# EAGLE design Adapter-IO4-Breakout (EAGLE 7.7.0)
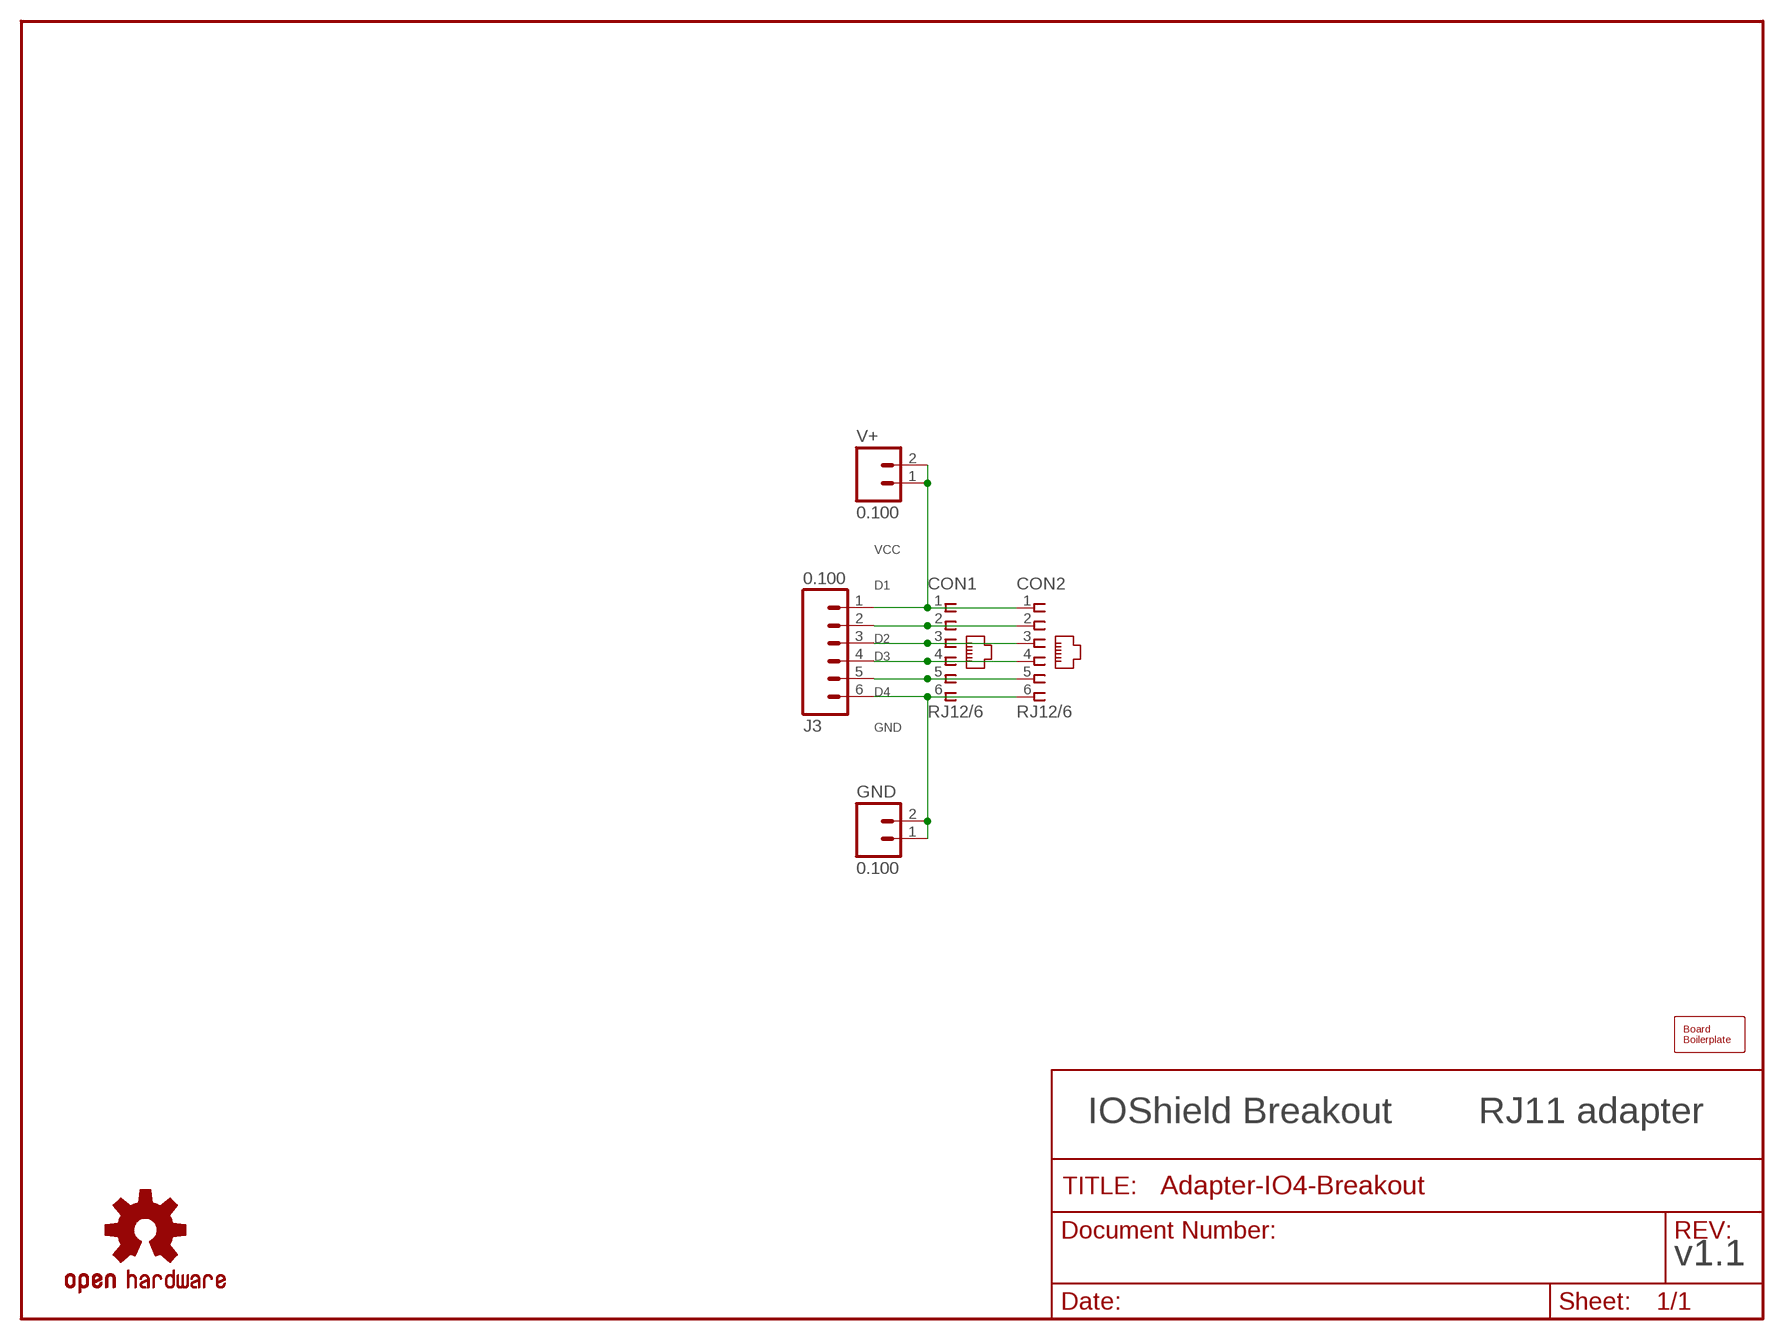
[diagram p0: schematic, sheet 1]

## Parts
BOARD1  BOARD  BOARD50X50-NOHOLES  [BOARD-SEEED5X5-NOHOLES]
CON1  RJ12/6  CONNECTOR-RJ25-6P6C  [RJ25-PANEL]
CON2  RJ12/6  CONNECTOR-RJ25-6P6C  [RJ25-PANEL]
GND  0.100  CONNECTOR-M021X02-LOCK  [1X02_LOCK]
J3  0.100  CONNECTOR-M06LOCK  [1X06_LOCK]
U$1  OSHW  OSHW-LOGOM  [OSHW-LOGO-M]
V+  0.100  CONNECTOR-M021X02-LOCK  [1X02_LOCK]

## Nets
D1: CON1.2 CON2.2 J3.2
D2: CON1.3 CON2.3 J3.3
D3: CON1.4 CON2.4 J3.4
D4: CON1.5 CON2.5 J3.5
GND [power]: CON1.6 CON2.6 GND.1(A) GND.2(B) J3.6
VCC [power]: CON1.1 CON2.1 J3.1 V+.1(A) V+.2(B)

## Notes on the sheet
- IOShield Breakout | RJ11 adapter
- v1.1

## Library data of the parts
BOARD1 = SPCoast:BOARD
CON1 CON2 = SPCoast:CONNECTOR-RJ25: AMP connector; AMP: 520250-3; OPL: none
GND V+ = SPCoast:CONNECTOR-M02: PHOENIX CONNECTOR
J3 = SPCoast:CONNECTOR-M06: Header 6 Standard 6-pin 0.1" header
U$1 = SparkFun:OSHW-LOGO: Open Source Hardware Logo This logo indicates the piece of hardware it is found on incorporates a OSHW license and/or adheres to the definition of open source hardware found here: http://freedomdefined.org/OSHW

## Net classes
0 default: width 0.305 mm, drill 0.6 mm, clearance 0.152 mm
1 power: width 0.61 mm

## Board
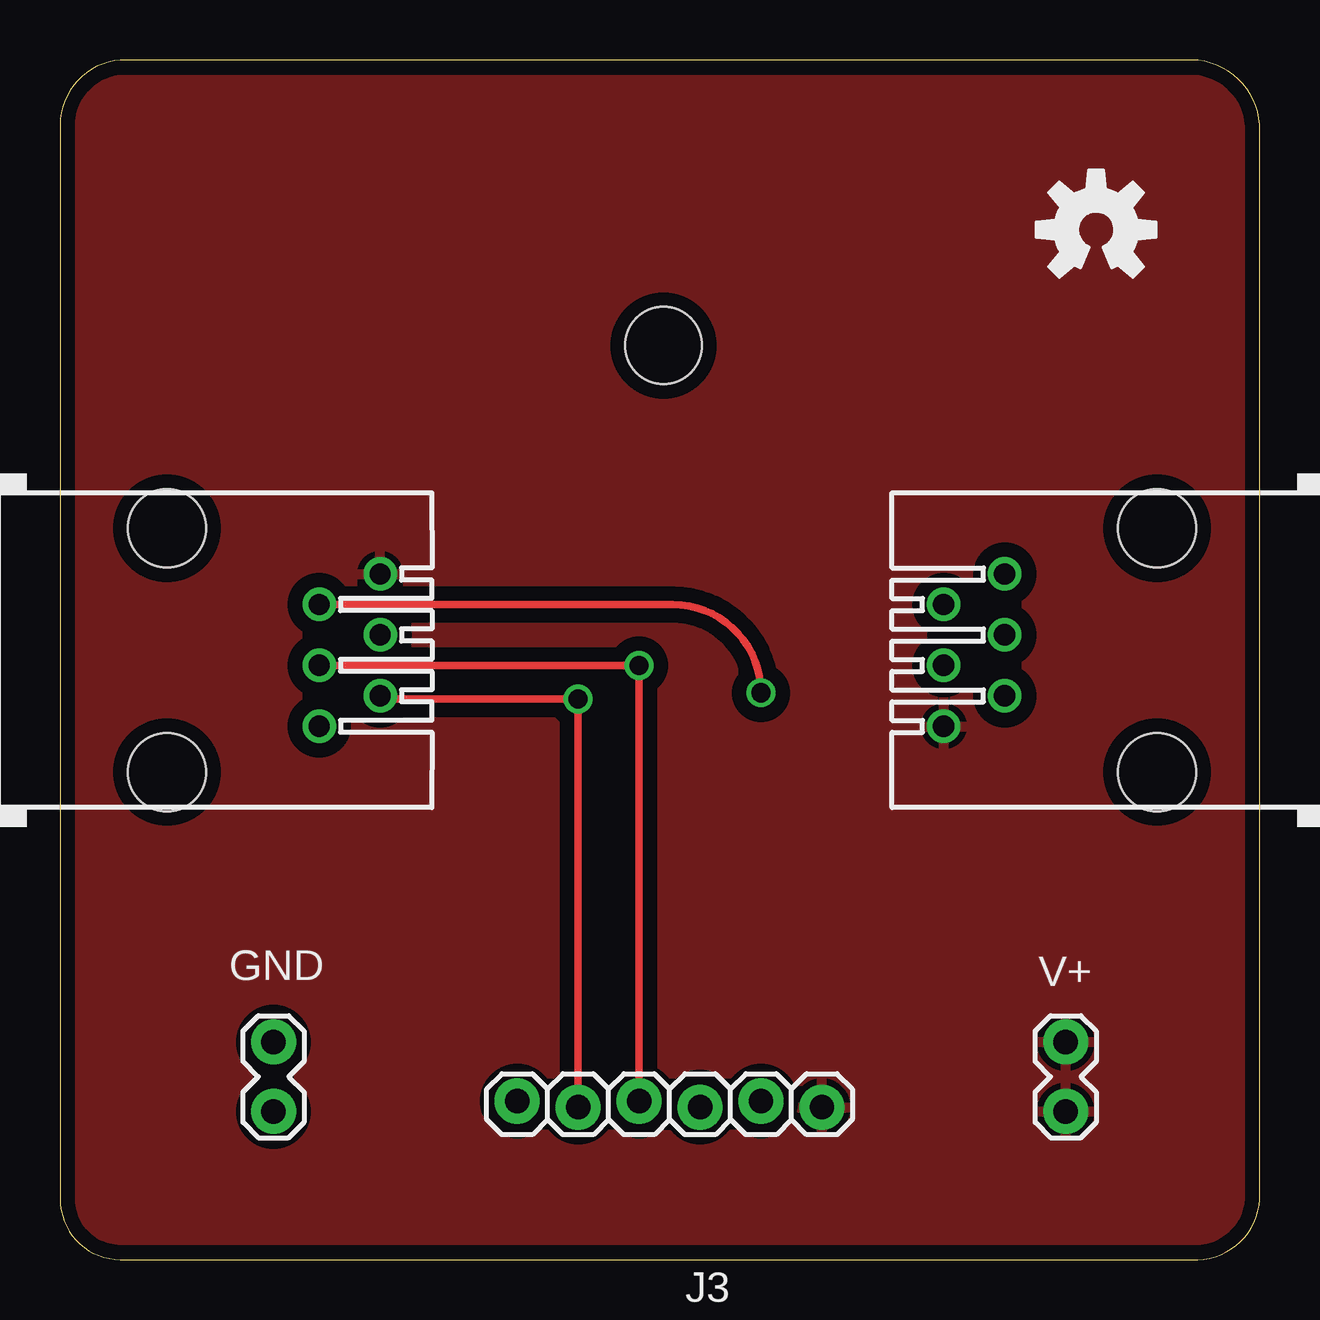
[diagram p1: board, top side]
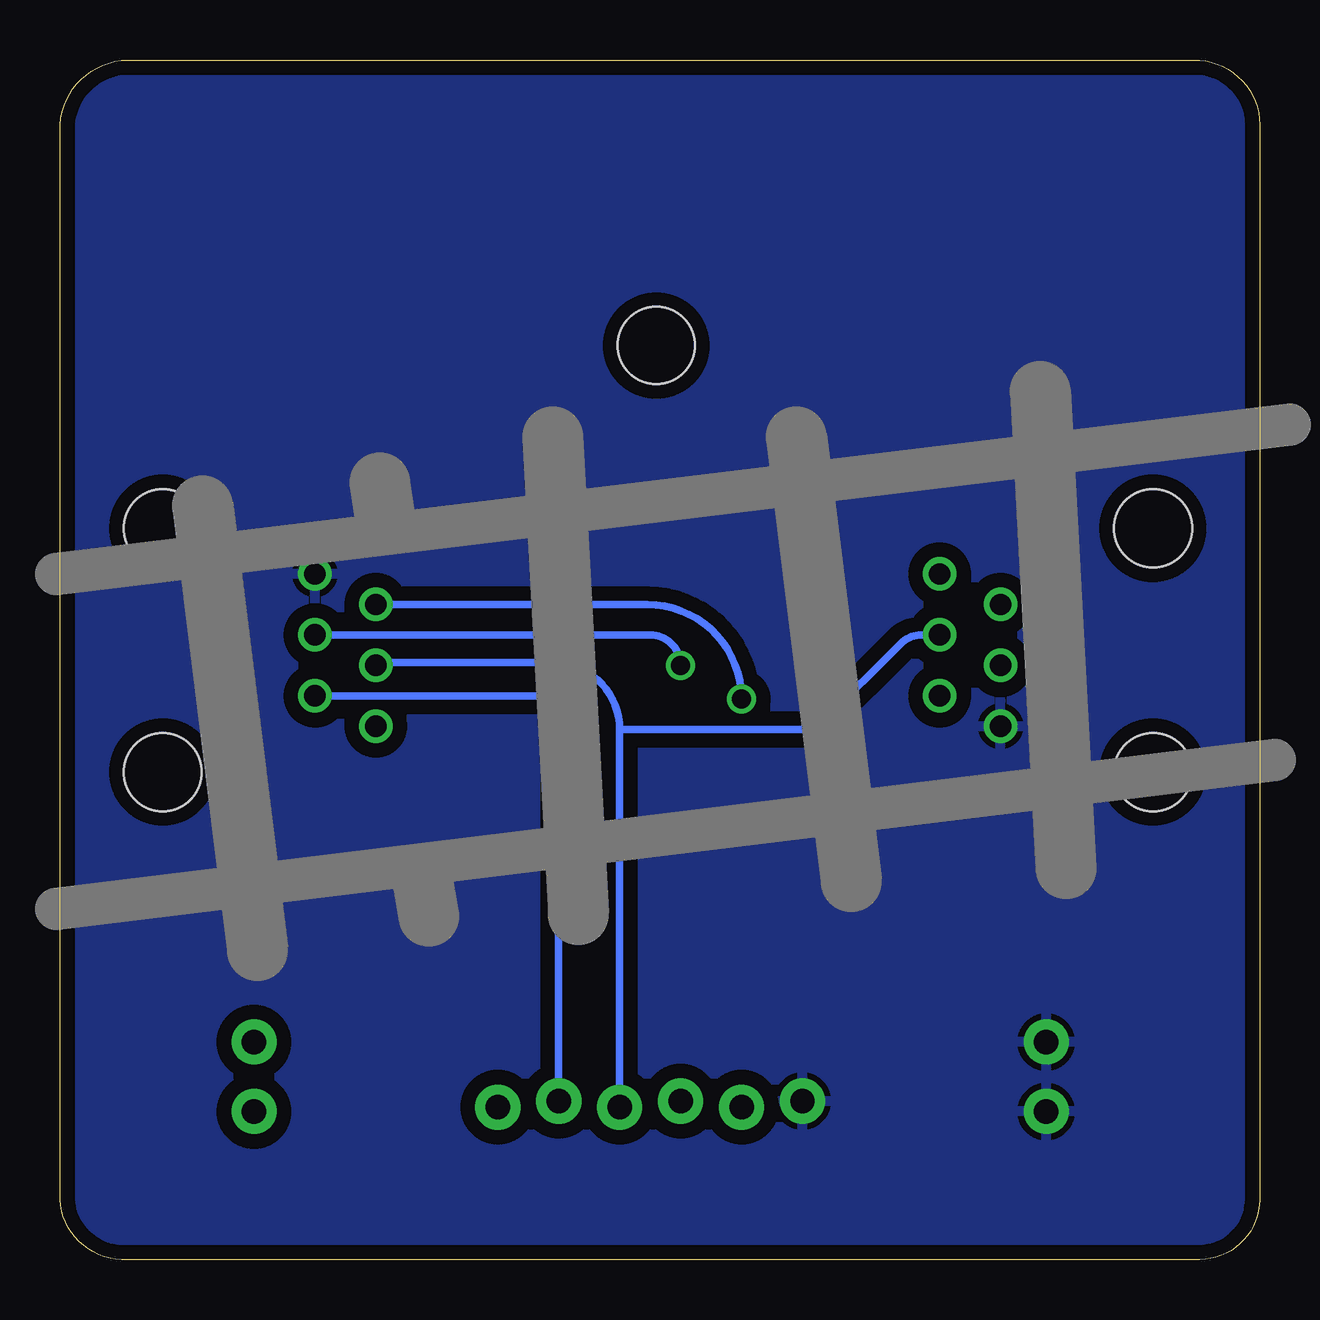
[diagram p2: board, bottom side, seen from below]

Size 50.01 x 50 mm. Coordinates in mm from the lower left corner, seen from the top.
Copper layers (1*16): Top 0.035mm / dielectric 1.5mm / Bottom 0.035mm
Design rules "Fusion_eagle_rule_v1.1": minimum track width 6mil, minimum drill 12mil, track to track 6mil, track to pad 6mil, pad to pad 6mil, via to via 6mil, smd to smd 0mil, copper to edge 10mil, drill to drill 10mil, minimum pad ring 10mil, minimum via ring 6mil, stop-mask expansion 2mil, vias tented up to drill 100mil, thermal gap 10mil
Holes 3.2 mm at 25.16,38.1

### Footprints (pad centres in the part's own frame; a part is rotated, then mirrored left to right if it is on the bottom)
RJ25-PANEL = drill 0.889: 1 -3.175,8.89; 2 -1.905,6.35; 3 -0.635,8.89; 4 0.635,6.35; 5 1.905,8.89; 6 3.175,6.35 | hole 3.251: -5.08,0; 5.08,0
1X02_LOCK = drill 1.016 pad 1.88: 1 -0.178,0; 2 2.718,0
1X06_LOCK = drill 1.016 pad 1.88: 1 0,0; 2 2.54,-0.254; 3 5.08,0; 4 7.62,-0.254; 5 10.16,0; 6 12.7,-0.254

### Placement (x,y rotation side)
BOARD1  0.01,0 0 top
CON1  45.73,25.4 90 top
CON2  4.45,25.4 270 top
GND  8.9,6.35 90 top
J3  31.76,6.35 180 top
U$1  43.19,42.93 0 top
V+  41.92,6.35 90 top

### Tracks (layer width: path | path; a pad name or v marks a point on that pad's centre or on a via)
D1  (via drill 0.8)
  Top 0.305: CON2.2 25.54,27.31 arc-90 v29.22,23.63
  Bottom 0.305: J3.2 v29.22,23.63 29.35,23.5 CON1.2
D2
  Bottom 0.305: J3.3 26.68,22.1 | CON2.3 14.09,26.04 arc-45 14.99,25.67 18.18,22.47 arc45 19.08,22.1 26.68,22.1 | 26.68,22.1 arc-90 29.47,24.9 36.84,24.9 CON1.3
D3  (via drill 0.8)
  Top 0.305: CON2.4 v24.14,24.77 J3.4
  Bottom 0.305: v24.14,24.77 arc-90 25.41,26.04 CON1.4
D4  (via drill 0.8)
  Top 0.305: J3.5 v21.6,23.37 13.34,23.37 CON2.5
  Bottom 0.305: v21.6,23.37 arc-90 25.54,27.31 CON1.5
GND
  pour Bottom (isolate 0.61): -0.37,50.8 51.19,50.8 51.19,-0.63 -0.37,-0.63
VCC
  pour Top (isolate 0.61): -0.37,50.8 51.19,50.8 51.19,-0.63 -0.37,-0.63

### Text on the board
tDocu: Open Source | IO4 Breakout | 6-wire passthrough | Hardware | John Plocher | v1.0 | 2015.11 | 4 | 3 | 2 | 1 | Gnd | V+
bDocu: Made in the PCR, Coast Division, NMRA | IO4 Breakout | SP Coast | .com | www. | Solder Side | Go Bears! | Model Railroading is fun!